# EAGLE design v3 (EAGLE 7.2.0)
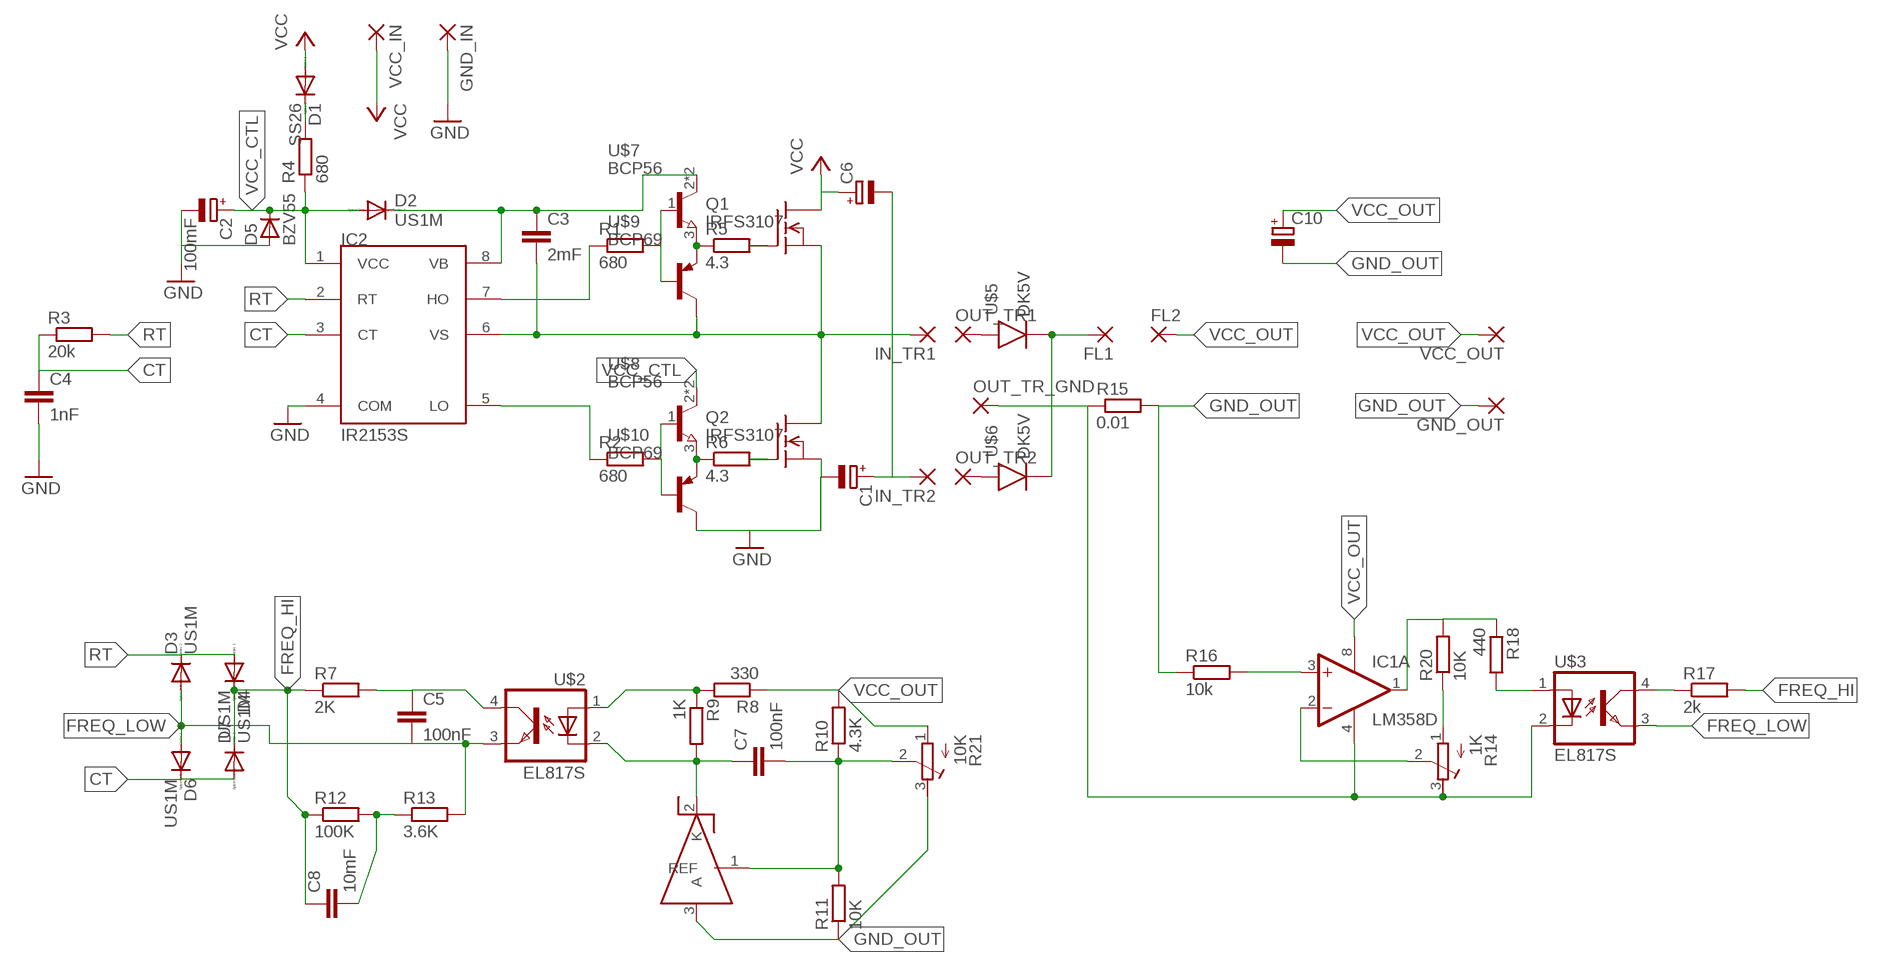
[diagram p0: schematic, sheet 1]

## Parts
C1  CPOL-EUE10-22.5  [EB22,5D]
C2  100mF  CPOL-EUE5-10.5  [E5-10,5]
C3  2mF  C-EUC0805  [C0805]
C4  1nF  C-EUC0805  [C0805]
C5  100nF  C-EUC0805  [C0805]
C6  CPOL-EUE10-22.5  [EB22,5D]
C7  100nF  C-EUC0805  [C0805]
C8  10mF  C-EUC0805  [C0805]
C10  CPOL-EUE7.5-18  [E7,5-18]
D1  SS26  DIODE-DO-214AC  [DO-214AC]
D2  US1M  DIODE-DO-214AC  [DO-214AC]
D3  US1M  DIODE-DO-214AC  [DO-214AC]
D4  US1M  DIODE-DO-214AC  [DO-214AC]
D5  BZV55  D-SOD-80  [SOD80]
D6  US1M  DIODE-DO-214AC  [DO-214AC]
D7  US1M  DIODE-DO-214AC  [DO-214AC]
FL1  3,81/1,4  [3,81/1,4]
FL2  3,81/1,4  [3,81/1,4]
GND_IN  3,81/1,4  [3,81/1,4]
GND_OUT  3,81/1,4  [3,81/1,4]
IC1  LM358D  [SO08]
IC2  IR2153S  [SO08]
IN_TR1  3,81/1,4  [3,81/1,4]
IN_TR2  3,81/1,4  [3,81/1,4]
OUT_TR1  3,81/1,4  [3,81/1,4]
OUT_TR2  3,81/1,4  [3,81/1,4]
OUT_TR_GND  3,81/1,4  [3,81/1,4]
Q1  IRFS3107  IRF510D2PAK  [D2PAK]
Q2  IRFS3107  IRF510D2PAK  [D2PAK]
R1  680  R-EU_R0805  [R0805]
R2  680  R-EU_R0805  [R0805]
R3  20k  R-EU_R0805  [R0805]
R4  680  R-EU_R0805  [R0805]
R5  4.3  R-EU_R0805  [R0805]
R6  4.3  R-EU_R0805  [R0805]
R7  2K  R-EU_R0805  [R0805]
R8  330  R-EU_R0805  [R0805]
R9  1K  R-EU_R0805  [R0805]
R10  4.3K  R-EU_R0805  [R0805]
R11  10K  R-EU_R0805  [R0805]
R12  100K  R-EU_R0805  [R0805]
R13  3.6K  R-EU_R0805  [R0805]
R14  1K  R-TRIMM3296W  [RTRIM3296W]
R15  0.01  R-EU_R2512  [R2512]
R16  10k  R-EU_M0805  [M0805]
R17  2k  R-EU_M0805  [M0805]
R18  440  R-EU_M0805  [M0805]
R20  10K  R-EU_M0805  [M0805]
R21  10K  R-TRIMM3296W  [RTRIM3296W]
U$1  TL431  TL431AIDBZR  [SOT23]
U$2  EL817S  [SMD4_L]
U$3  EL817S  [SMD4_L]
U$5  DK5V  DK5V100R10ST1  [TO220(V)]
U$6  DK5V  DK5V100R10ST1  [TO220(V)]
U$7  BCP56  [SOT223]
U$8  BCP56  [SOT223]
U$9  BCP69  [SOT223]
U$10  BCP69  [SOT223]
VCC_IN  3,81/1,4  [3,81/1,4]
VCC_OUT  3,81/1,4  [3,81/1,4]

## Nets
CT: C4.1 D6.C D7.A IC2.3(CT) R3.1
FREQ_HI: C8.1 D4.C D7.C R7.1 R12.1 R17.2
FREQ_LOW: C5.2 D3.A D6.A R13.2 U$2.3(EMIT) U$3.3(EMIT)
GND: C1.- C2.- C4.2 D5.2(A) GND_IN.1(P) IC2.4(COM) Q2.3(S) U$10.2(C) U$10.4(C)
GND_OUT: C10.- GND_OUT.1(P) R11.1 R15.2 R16.1 R21.3(E) U$1.3(A)
IN_TR1: C3.2 IC2.6(VS) IN_TR1.1(P) Q1.3(S) Q2.2(D) U$9.2(C) U$9.4(C)
IN_TR2: C1.+ C6.- IN_TR2.1(P)
N$1: R1.2 U$7.1(B) U$9.1(B)
N$2: R2.2 U$8.1(B) U$10.1(B)
N$3: OUT_TR1.1(P) U$5.IN(A)
N$4: R5.1 U$7.3(E) U$9.3(E)
N$5: R6.1 U$8.3(E) U$10.3(E)
N$6: Q1.1(G) R5.2
N$7: OUT_TR2.1(P) U$6.IN(A)
N$8: C5.1 R7.2 U$2.4(COL)
N$9: Q2.1(G) R6.2
N$10: IC2.7(HO) R1.1
N$11: IC2.5(LO) R2.1
N$12: D1.C R4.2
N$13: C7.1 R9.2 U$1.2(K) U$2.2(C)
N$15: C7.2 R10.1 R11.2 R21.2(S) U$1.1(REF)
N$16: R8.2 R9.1 U$2.1(A)
N$17: C8.2 R12.2 R13.1
N$19: R18.2 U$3.1(A)
N$20: IC1.3(A:+IN) R16.2
N$21: IC1.4(P:V-) OUT_TR_GND.1(P) R14.3(E) R15.1 U$3.2(C)
N$22: IC1.1(A:OUT) R18.1 R20.2
N$23: IC1.2(A:-IN) R14.2(S)
N$24: R14.1(A) R20.1
N$26: R17.1 U$3.4(COL)
RT: D3.C D4.A IC2.2(RT) R3.2
VB: C3.1 D2.C IC2.8(VB) U$7.2(C) U$7.4(C)
VCC: C6.+ D1.A Q1.2(D) VCC_IN.1(P)
VCC_CTL: C2.+ D2.A D5.1(C) IC2.1(VCC) R4.1 U$8.2(C) U$8.4(C)
VCC_OUT: C10.+ FL2.1(P) IC1.8(P:V+) R8.1 R10.2 R21.1(A) VCC_OUT.1(P)
VCC_RECTIFIER: FL1.1(P) U$5.GND(K) U$6.GND(K)
Unconnected: IC1.5(B:+IN) IC1.6(B:-IN) IC1.7(B:OUT)

## Library data of the parts
C1 C2 C6 C10 = rcl:CPOL-EU: POLARIZED CAPACITOR, European symbol
C3-C5 C8 = rcl:C-EU: CAPACITOR, European symbol
C7 = resistor:C-EU: CAPACITOR, European symbol
D1-D4 D6 D7 = diode:DIODE-: DIODE
D5 = semicon-smd-ipc:D-: DIODE unfilled
FL1 FL2 GND_IN GND_OUT IN_TR1 IN_TR2 OUT_TR1 OUT_TR2 OUT_TR_GND VCC_IN VCC_OUT = wirepad:3,81/1,4: THROUGH-HOLE PAD
IC1 = linear:LM358: OP AMP also LM158; LM258; LM2904 Source: http://cache.national.com/ds/LM/LM158.pdf
IC2 = irs:IR2153
Q1 Q2 = my_mixed:IRF510: N-Channel Enhancement MOSFET (HEXFET); 100V; 5,6A; 0,54Ohm
R1-R7 R12 R13 R15-R18 R20 = rcl:R-EU_: RESISTOR, European symbol
R8-R11 = resistor:R-EU_: RESISTOR, European symbol
R14 R21 = rcl:R-TRIMM: Trimm resistor
U$1 = my_mixed:TL431AIDBZR
U$2 U$3 = my_mixed:EL817S
U$5 U$6 = my_mixed:DK5V100R10ST1
U$7 U$8 = my_mixed:BCP56
U$9 U$10 = my_mixed:BCP69

## Board
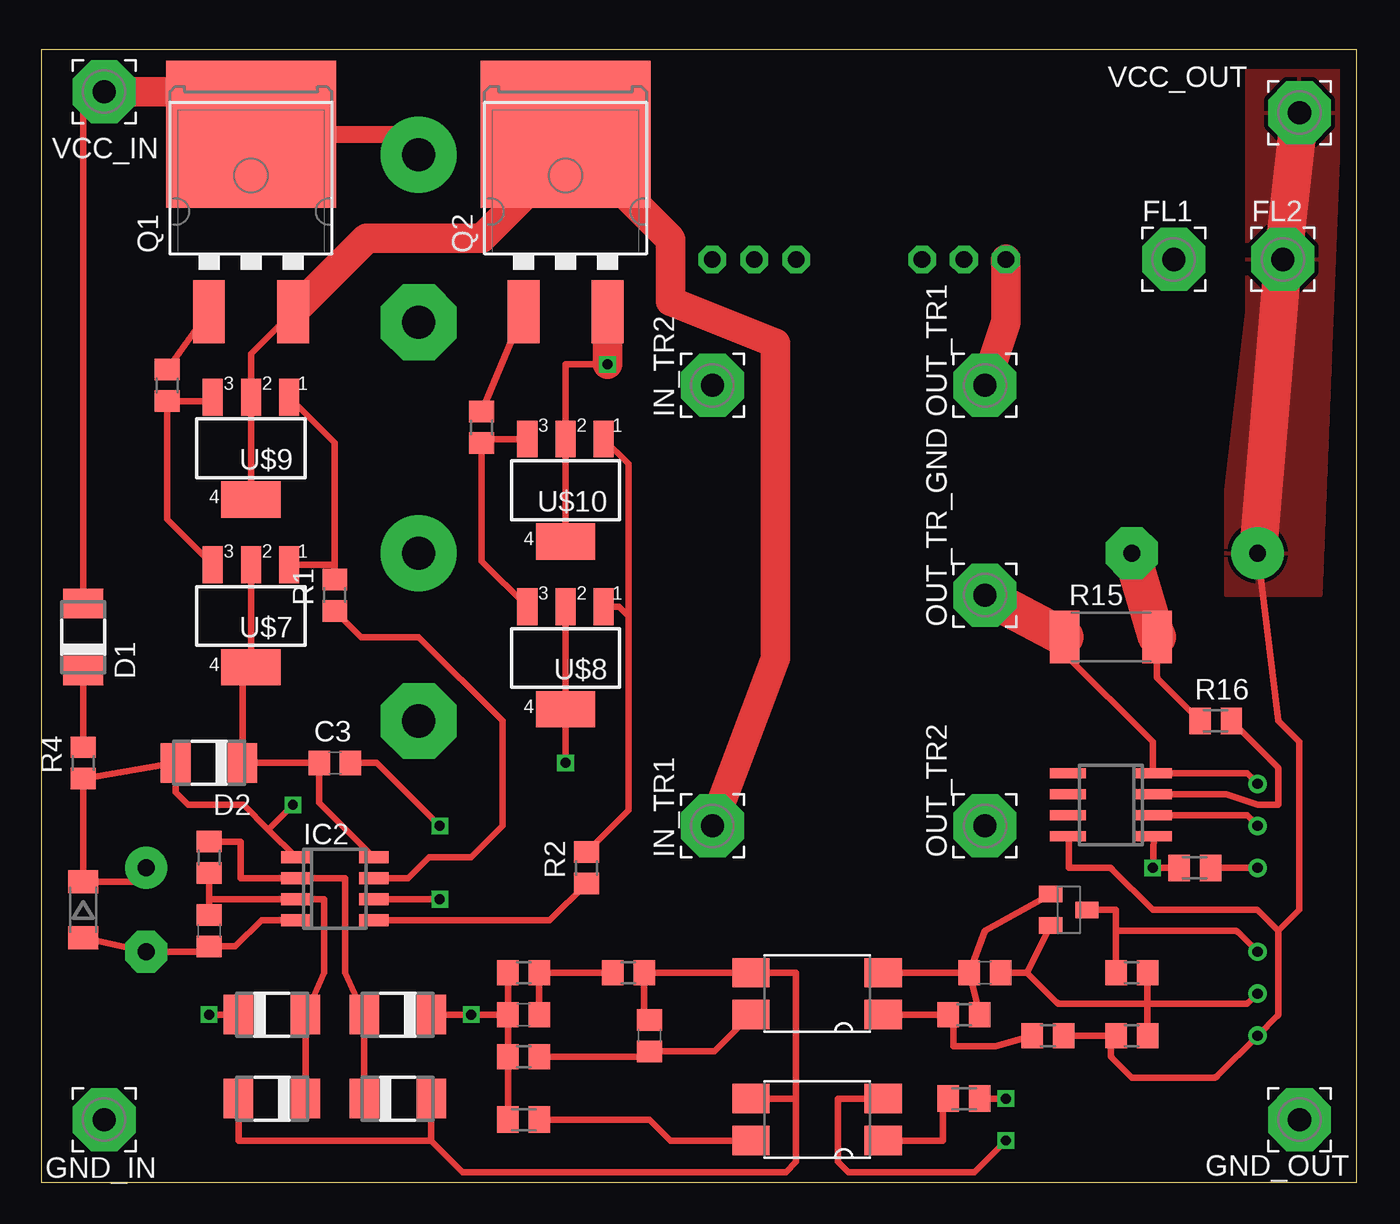
[diagram p1: board, top side]
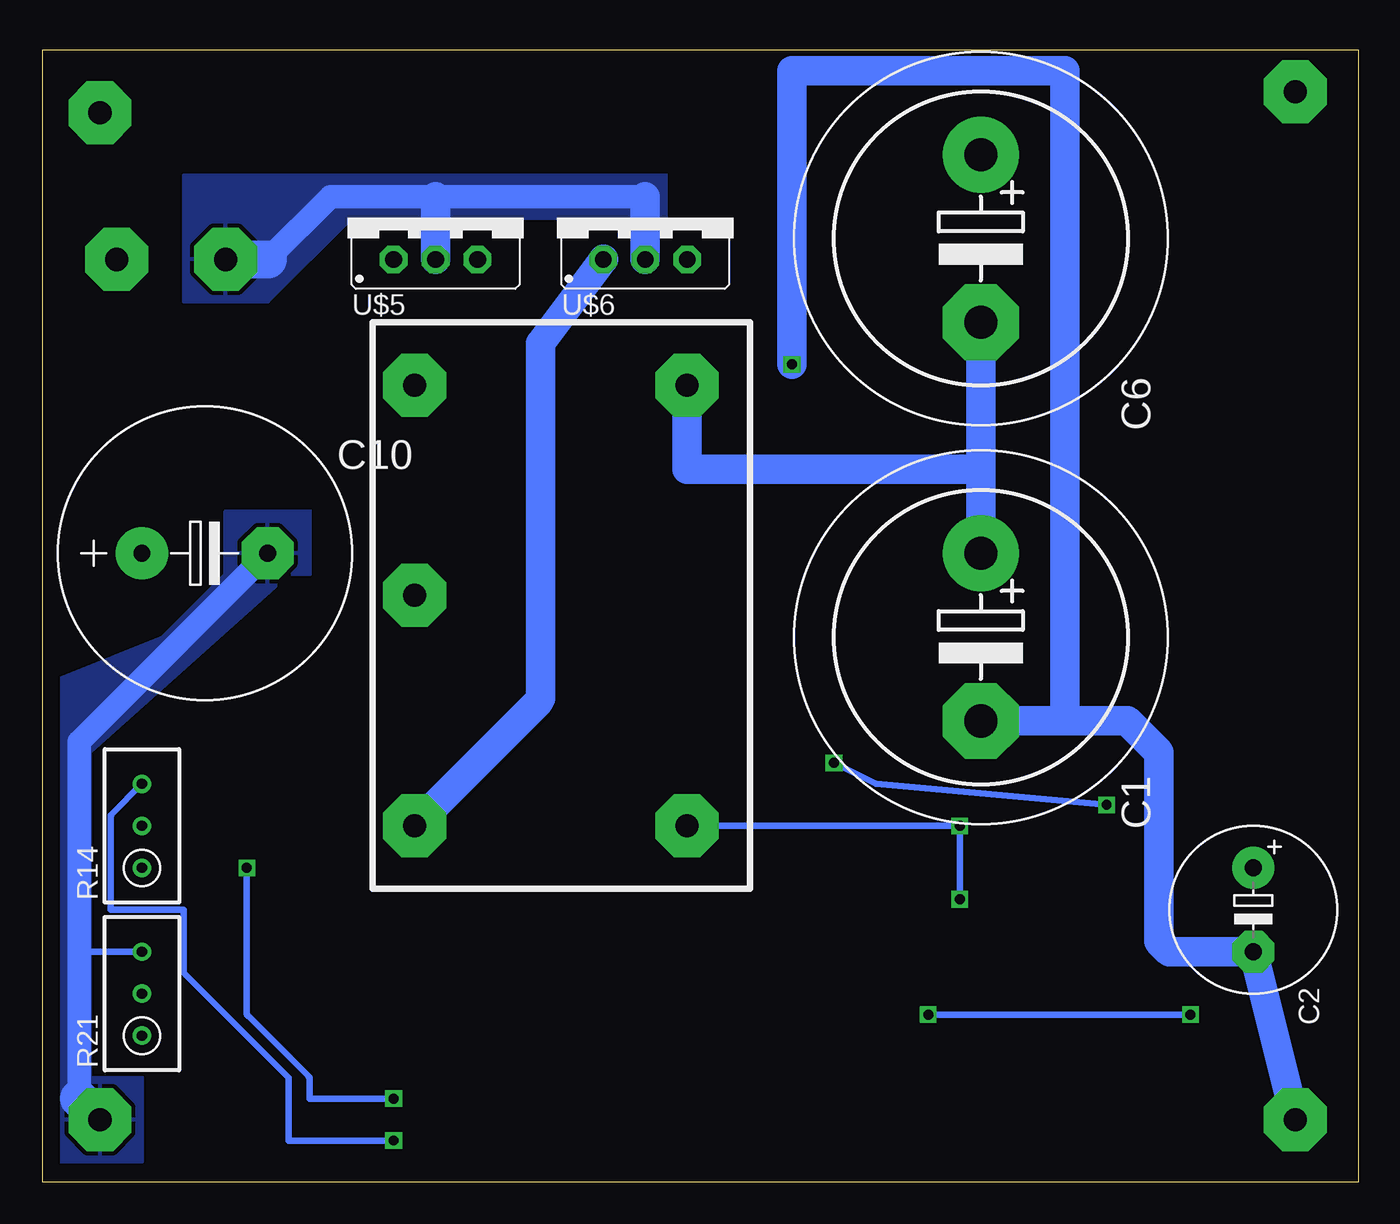
[diagram p2: board, bottom side, seen from below]

Size 79.68 x 68.57 mm. Coordinates in mm from the lower left corner, seen from the top.
Outline: 0,0 79.68,0 79.68,68.57 0,68.57 0,0
Copper layers (1*16): Top 0.035mm / dielectric 1.5mm / Bottom 0.035mm
Design rules "default": minimum track width 10mil, minimum drill 24mil, track to track 8mil, track to pad 8mil, pad to pad 8mil, via to via 8mil, smd to smd 8mil, copper to edge 40mil, drill to drill 8mil, minimum pad ring 10mil, minimum via ring 8mil, stop-mask expansion 4mil, vias tented up to drill 0mil, thermal gap 10mil

### Footprints (pad centres in the part's own frame; a part is rotated, then mirrored left to right if it is on the bottom)
EB22,5D = drill 2.007 pad 4.597: + -5.08,0 | drill 2.007 pad 4.597 octagon: - 5.08,0
E5-10,5 = drill 1.016 pad 2.54: + -2.54,0 | drill 1.016 pad 2.54 octagon: - 2.54,0
C0805 = smd 1.3 x 1.5: 1 -0.95,0; 2 0.95,0
E7,5-18 = drill 1.016 pad 3.15: + -3.81,0 | drill 1.016 pad 3.15 octagon: - 3.81,0
DO-214AC = smd 1.8 x 2.4: A 2.025,0; C -2.025,0
SOD80 = smd 1.4 x 1.8: 1 -1.7,0; 2 1.7,0
3,81/1,4 = drill 1.397 pad 3.81 octagon: 1 0,0
SO08 = smd 0.6 x 2.2: 1 -1.905,-2.6; 2 -0.635,-2.6; 3 0.635,-2.6; 4 1.905,-2.6; 5 1.905,2.6; 6 0.635,2.6; 7 -0.635,2.6; 8 -1.905,2.6
SO08' = smd 0.72 x 1.78: 1 -1.905,-2.35; 2 -0.635,-2.35; 3 0.635,-2.35; 4 1.905,-2.35; 5 1.905,2.35; 6 0.635,2.35; 7 -0.635,2.35; 8 -1.905,2.35
D2PAK = smd 1.93 x 3.81: 1 -2.55,-8.25; 3 2.55,-8.25 | smd 10.3 x 8.9: 2 0,2.5
R0805 = smd 1.3 x 1.5: 1 -0.95,0; 2 0.95,0
RTRIM3296W = drill 0.61: 1 0,-2.54; 2 0,0; 3 0,2.54
R2512 = smd 1.8 x 3.2: 1 -2.8,0; 2 2.8,0
M0805 = smd 1.3 x 1.6: 1 -0.95,0; 2 0.95,0
SOT23 = smd 1 x 1.4: 1 0.95,-1.1; 2 -0.95,-1.1; 3 0,1.1
SMD4_L = smd 1.78 x 2.25: 1 0,-4; 2 2.54,-4; 3 2.54,4; 4 0,4
TO220(V) = drill 1.016 pad 1.676 octagon: GND 0,0; IN -2.54,0; OUT 2.54,0
SOT223 = smd 1.219 x 2.235: 1 -1.041,-0.559; 2 1.27,-0.559; 3 3.581,-0.559 | smd 3.6 x 2.2: 4 1.27,5.639

### Placement (x,y rotation side)
C1  22.86,33.02 270 bottom
C2  6.35,16.51 270 bottom
C3  17.78,25.4 0 top
C4  10.16,15.24 270 top
C5  36.83,8.89 90 top
C6  22.86,57.15 270 bottom
C7  57.15,12.7 0 top
C8  29.21,10.16 0 top
C10  69.85,38.1 0 bottom
D1  2.54,33.02 90 top
D2  10.16,25.4 180 top
D3  21.59,5.08 0 top
D4  21.59,10.16 180 top
D5  2.54,16.51 270 top
D6  13.97,5.08 180 top
D7  13.97,10.16 0 top
FL1  68.58,55.88 0 top
FL2  75.2,55.88 0 top
GND_IN  3.81,3.81 90 top
GND_OUT  76.2,3.81 270 top
IC1  64.77,22.86 90 top
IC2  IR2153S  [SO08']  17.78,17.78 270 top
IN_TR1  40.64,21.59 90 top
IN_TR2  40.64,48.26 90 top
OUT_TR1  57.15,48.26 90 top
OUT_TR2  57.15,21.59 90 top
OUT_TR_GND  57.15,35.56 90 top
Q1  12.7,60.96 0 top
Q2  31.75,60.96 0 top
R1  17.78,35.56 90 top
R2  33.02,19.05 90 top
R3  10.16,19.68 90 top
R4  2.54,25.4 90 top
R5  7.62,48.26 90 top
R6  26.67,45.72 90 top
R7  29.21,7.62 0 top
R8  60.96,8.89 180 top
R9  55.88,10.16 0 top
R10  66.04,8.89 180 top
R11  66.04,12.7 0 top
R12  29.21,12.7 0 top
R13  35.56,12.7 0 top
R14  73.66,21.59 0 bottom
R15  64.77,33.02 0 top
R16  71.12,27.94 0 top
R17  29.21,3.81 180 top
R18  55.88,5.08 180 top
R20  69.85,19.05 180 top
R21  73.66,11.43 0 bottom
U$1  62.23,16.51 270 top
U$2  46.99,10.16 90 top
U$3  46.99,2.54 90 top
U$5  55.88,55.88 0 bottom
U$6  43.18,55.88 0 bottom
U$7  13.97,36.83 180 top
U$8  33.02,34.29 180 top
U$9  13.97,46.99 180 top
U$10  33.02,44.45 180 top
VCC_IN  3.81,66.04 90 top
VCC_OUT  76.2,64.77 90 top

### Tracks (layer width: path | path; a pad name or v marks a point on that pad's centre or on a via)
CT
  Top 0.406: R3.1 10.16,17.14 | 10.16,17.14 C4.1 | 10.16,17.14 IC2.3 17.14,17.14 17.14,12.7 D7.A D6.C
FREQ_HI  (via drill 0.6)
  Top 0.406: R12.1 C8.1 | C8.1 R7.1 R17.2 | D4.C v26.04,10.16 C8.1 | v10.16,10.16 D7.C
  Bottom 0.406: v26.04,10.16 v10.16,10.16
FREQ_LOW
  Top 0.406: D6.A 11.95,2.54 23.61,2.54 | 23.61,2.54 D3.A | 23.61,2.54 25.52,0.64 45.09,0.64 45.72,1.27 45.72,5.08 | 45.72,5.08 45.72,12.7 U$2.3 R13.2 36.51,10.16 C5.2 | 45.72,5.08 U$3.3
GND  (via drill 0.6)
  Top 0.406: D5.2 C2.- 9.84,13.97 arc90 C4.2 11.75,14.29 13.34,15.88 IC2.4 | U$10.4 U$10.2 31.75,49.53 v34.29,49.53
  Top 1.778: Q2.3 v34.29,49.53
  Bottom 1.778: GND_IN.1 C2.- 11.43,13.97 12.06,14.61 12.06,26.04 13.97,27.94 17.78,27.94 | C1.- 17.78,27.94 | v34.29,49.53 34.29,67.31 17.78,67.31 17.78,27.94
GND_OUT
  Top 0.406: U$1.3 65.09,16.51 65.09,15.24 | R16.1 67.64,30.47 arc-45 67.57,30.64 R15.2 | 65.09,15.24 R11.1 | R21.3 72.46,15.17 arc45 72.28,15.24 65.09,15.24
  Top 2.286: R15.2 C10.-
  Bottom 0.406: R21.3 77.47,13.97
  Bottom 1.422: C10.- 77.47,26.67 77.47,5.08
  Bottom 2.286: 77.47,5.08 GND_OUT.1
  pour Bottom: 63.5,40.64 63.5,36.83 64.77,36.83 76.83,26.04 76.83,6.35 73.66,6.35 73.66,1.27 78.74,1.27 78.74,30.48 72.39,33.02 68.58,36.83 68.58,40.64
IN_TR1  (via drill 0.6)
  Top 0.406: U$9.4 U$9.2 12.7,50.16 Q1.3 | C3.2 20.32,25.4 v24.13,21.59 | v24.13,17.14 IC2.6 | 31.75,62.23 Q2.2
  Top 1.778: Q2.2 38.1,57.11 38.1,53.34 44.45,50.8 44.45,31.75 IN_TR1.1 | Q1.3 19.69,57.15 26.67,57.15 31.75,62.23
  Bottom 0.406: IN_TR1.1 v24.13,21.59 v24.13,17.14
IN_TR2
  Bottom 1.778: C1.+ 22.86,43.18 | 22.86,43.18 C6.- | IN_TR2.1 40.64,43.18 22.86,43.18
N$1
  Top 0.406: U$7.1 17.78,37.39 | 17.78,37.39 R1.2 | U$9.1 17.78,44.78 17.78,37.39
N$2
  Top 0.406: R2.2 35.56,22.54 35.56,34.29 | 35.56,34.29 35,34.85 U$8.1 | U$10.1 35.56,43.51 35.56,34.29
N$3
  Top 1.778: OUT_TR1.1 58.42,52.07 U$5.IN
N$4
  Top 0.406: U$9.3 10.39,46.99 10.07,47.31 R5.1 7.62,40.16 U$7.3
N$5
  Top 0.406: U$10.3 26.91,45.01 R6.1 26.67,37.62 U$8.3
N$6
  Top 0.406: R5.2 Q1.1
N$7
  Bottom 1.422: 49.6,29.14 arc-45 49.53,29.32
  Bottom 1.778: OUT_TR2.1 49.6,29.14 | 49.53,29.32 49.53,50.8 U$6.IN
N$8
  Top 0.406: U$2.4 40.77,7.94 C5.1 36.51,7.62 R7.2
N$9
  Top 0.406: R6.2 Q2.1
N$10
  Top 0.406: IC2.7 22.23,18.41 23.5,19.68 26.04,19.68 27.94,21.59 27.94,27.94 22.86,33.02 19.37,33.02 R1.1
N$11
  Top 0.406: IC2.5 30.8,15.88 R2.1
N$12
  Top 0.406: R4.2 D1.C
N$13
  Top 0.406: U$2.2 C7.1 | C7.1 R9.2 | U$1.2 57.15,15.24 C7.1
N$15
  Top 0.406: C7.2 59.69,12.7 | 59.69,12.7 U$1.1 | R11.2 66.99,10.82 | 66.99,10.82 R10.1 | 66.99,10.82 61.67,10.82 arc-45 61.49,10.9 59.69,12.7 | R21.2 73.13,10.9 arc-45 72.95,10.82 66.99,10.82
N$16
  Top 0.406: U$2.1 R9.1 55.17,9.92 arc-45 55.24,9.74 55.24,8.26 57.78,8.26 R8.2
N$17
  Top 0.406: C8.2 R12.2 R13.1
N$19
  Top 0.406: U$3.1 54.61,2.54 54.61,4.76 R18.2
N$20
  Top 0.406: R16.2 74.86,25.15 arc-45 74.93,24.98 74.93,22.86 73.66,22.86 71.75,23.5 IC1.3
N$21  (via drill 0.6)
  Top 0.406: R15.1 61.97,32.01 67.31,26.67 67.31,24.82 IC1.4 73.03,24.77 R14.3 | U$3.2 48.26,5.08 48.26,1.27 48.9,0.64 56.52,0.64 v58.42,2.54
  Top 2.286: OUT_TR_GND.1 R15.1
  Bottom 0.406: v58.42,2.54 64.77,2.54 64.77,6.35 71.12,12.7 71.12,16.51 75.56,16.51 75.56,22.12 arc45 75.49,22.3 R14.3
N$22  (via drill 0.6)
  Top 0.406: R18.1 v58.42,5.08 | IC1.1 v67.31,19.05 R20.2
  Bottom 0.406: v58.42,5.08 63.5,5.08 63.5,6.25 arc-45 63.57,6.42 67.24,10.09 arc45 67.31,10.27 v67.31,19.05
N$23
  Top 0.406: R14.2 73.03,22.23 IC1.2
N$24
  Top 0.406: R14.1 R20.1
N$26
  Top 0.406: U$3.4 38.1,2.54 36.83,3.81 R17.1
RT
  Top 0.406: R3.2 12.06,20.64 12.06,18.41 IC2.2 18.41,18.41 18.41,12.7 D4.A D3.C
VB
  Top 0.406: IC2.8 16.83,22.98 C3.1 D2.C 12.19,30.68 U$7.4 U$7.2
VCC
  Top 0.406: D1.A 2.54,64.77 VCC_IN.1
  Top 1.016: 12.7,66.04 Q1.2 21.63,63.46 C6.+
  Top 1.778: VCC_IN.1 12.7,66.04
VCC_CTL  (via drill 0.6)
  Top 0.406: C2.+ 5.51,18.21 D5.1 R4.1 D2.A 8.13,23.61 8.89,22.86 12.26,22.86 13.75,21.37 | IC2.1 13.75,21.37 | U$8.2 U$8.4 v31.75,25.4 | v15.24,22.86 13.75,21.37
  Bottom 0.406: v31.75,25.4 29.21,24.13 v15.24,22.86
VCC_OUT
  Top 0.406: R8.1 64.77,8.89 | IC1.8 62.23,20.89 62.23,19.05 64.67,19.05 arc-45 64.84,18.98 67.31,16.51 73.56,16.51 arc-45 73.73,16.44 74.93,15.24 | 74.93,15.24 74.93,10.27 arc-45 74.86,10.09 R21.1 71.19,6.42 arc-45 71.02,6.35 66.04,6.35 64.84,7.55 arc-45 64.77,7.72 64.77,8.89 | C10.+ 74.93,27.94 76.13,26.74 arc-45 76.2,26.57 76.2,16.51 74.93,15.24 | R10.2 64.77,8.89
  Top 2.286: VCC_OUT.1 FL2.1 C10.+
  pour Top: 71.75,35.56 71.75,41.91 73.03,52.7 73.03,67.31 78.74,67.31 77.47,35.56
VCC_RECTIFIER
  Bottom 1.422: 43.18,59.69 55.88,59.69 62.23,59.69 66.04,55.88
  Bottom 1.778: U$6.GND 43.18,59.69 | 55.88,59.69 U$5.GND
  Bottom 2.286: FL1.1 66.04,55.88
  pour Bottom: 41.91,58.42 41.91,60.96 71.12,60.96 71.12,53.34 66.04,53.34 60.96,58.42